# EAGLE design 3OR_1 (EAGLE 6.5.0)
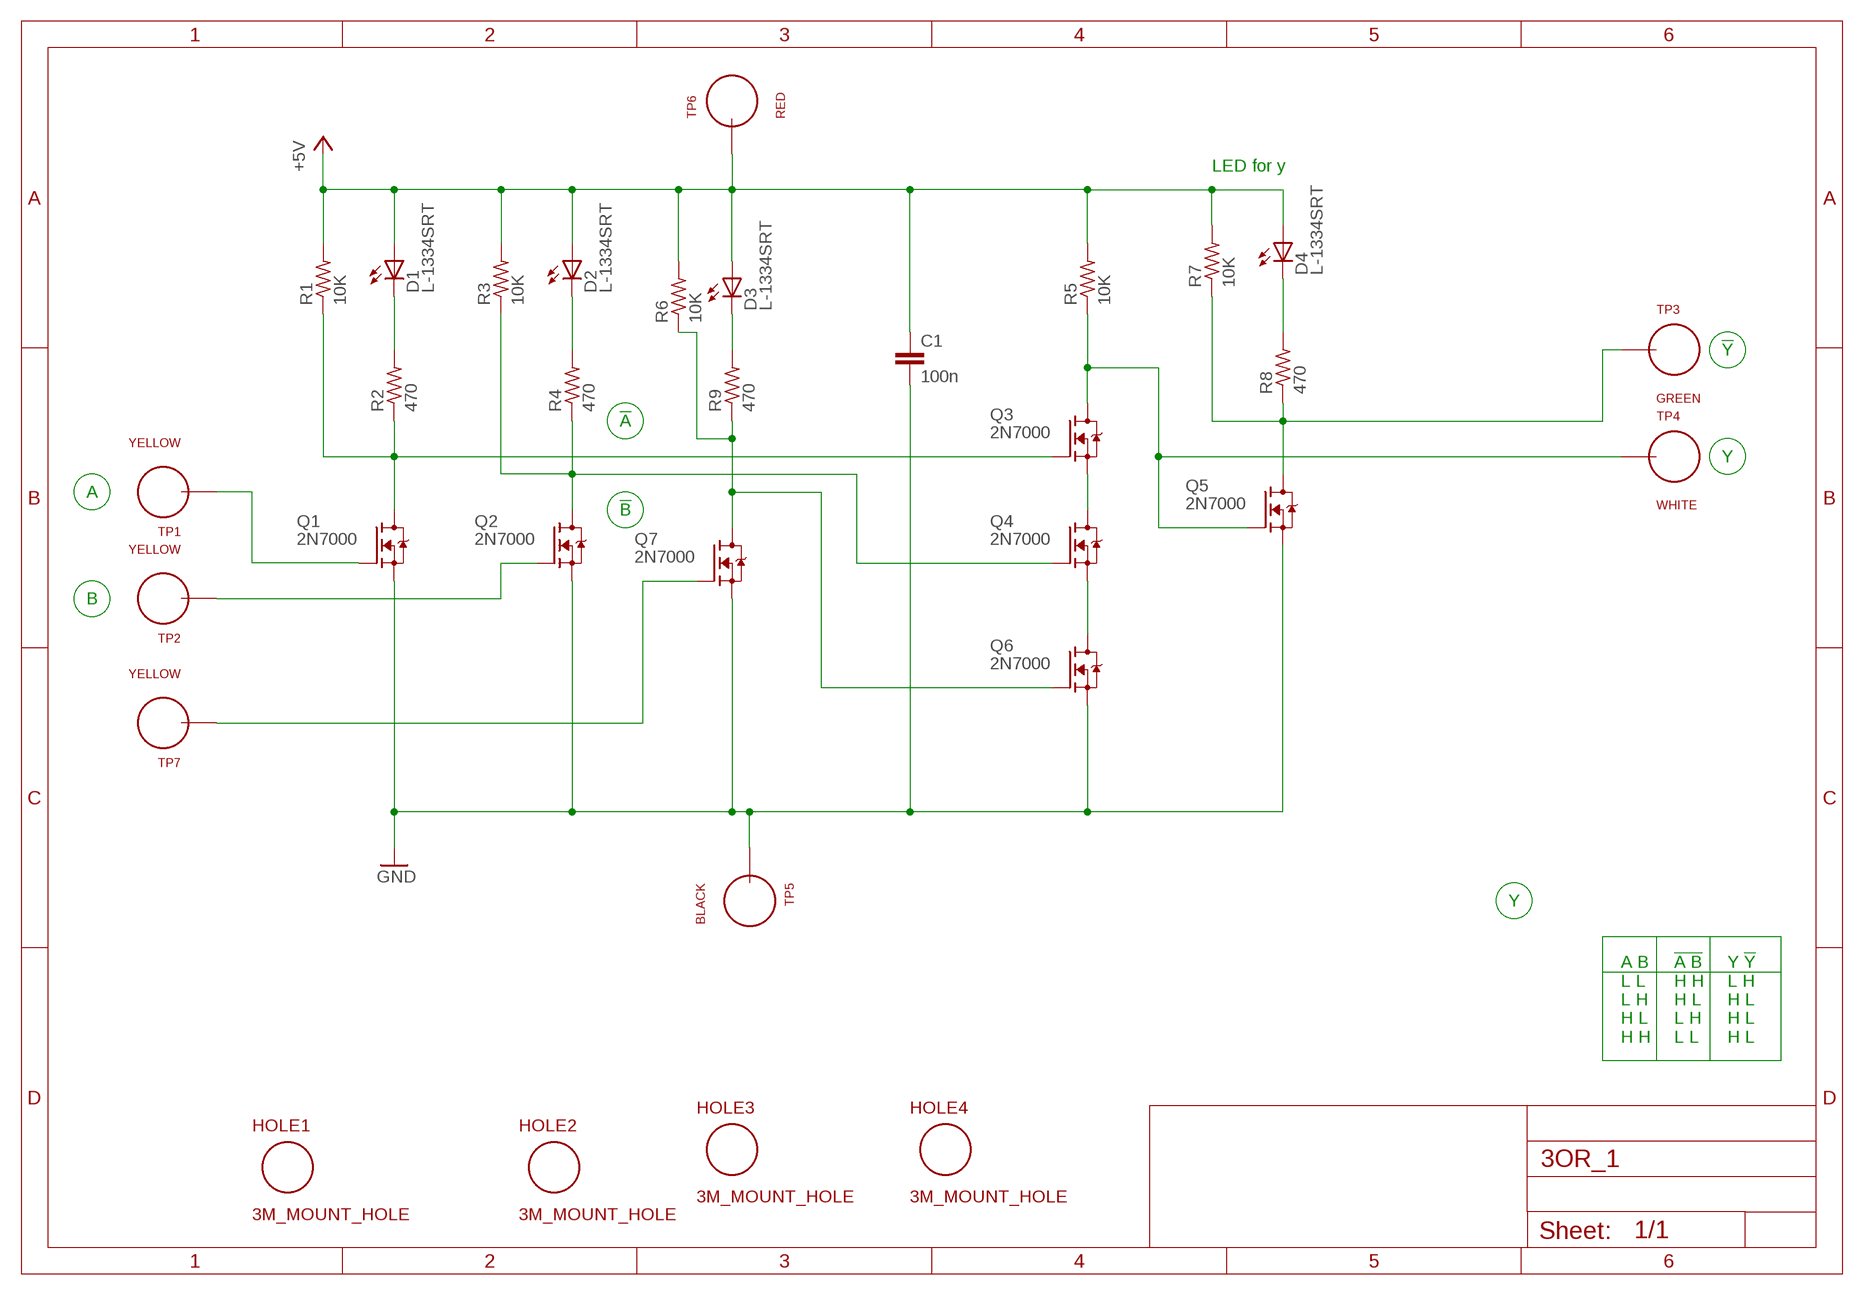
[diagram p0: schematic, sheet 1]

## Parts
C1  100n  C_P2INCH  [CAP_P2INCH]
D1  L-1334SRT  [LED3MM]
D2  L-1334SRT  [LED3MM]
D3  L-1334SRT  [LED3MM]
D4  L-1334SRT  [LED3MM]
HOLE1  3M_MOUNT_HOLE  [3M_HOLE]
HOLE2  3M_MOUNT_HOLE  [3M_HOLE]
HOLE3  3M_MOUNT_HOLE  [3M_HOLE]
HOLE4  3M_MOUNT_HOLE  [3M_HOLE]
Q1  2N7000  [TO92-DGS]
Q2  2N7000  [TO92-DGS]
Q3  2N7000  [TO92-DGS]
Q4  2N7000  [TO92-DGS]
Q5  2N7000  [TO92-DGS]
Q6  2N7000  [TO92-DGS]
Q7  2N7000  [TO92-DGS]
R1  10K  R_P2INCH  [R_P2INCH]
R2  470  R_P2INCH  [R_P2INCH]
R3  10K  R_P2INCH  [R_P2INCH]
R4  470  R_P2INCH  [R_P2INCH]
R5  10K  R_P2INCH  [R_P2INCH]
R6  10K  R_P2INCH  [R_P2INCH]
R7  10K  R_P2INCH  [R_P2INCH]
R8  470  R_P2INCH  [R_P2INCH]
R9  470  R_P2INCH  [R_P2INCH]
TP1  YELLOW  TEST_LOOP  [TEST_LOOP]
TP2  YELLOW  TEST_LOOP  [TEST_LOOP]
TP3  GREEN  TEST_LOOP  [TEST_LOOP]
TP4  WHITE  TEST_LOOP  [TEST_LOOP]
TP5  BLACK  TEST_LOOP  [TEST_LOOP]
TP6  RED  TEST_LOOP  [TEST_LOOP]
TP7  YELLOW  TEST_LOOP  [TEST_LOOP]

## Nets
+5V: C1.1 D1.A D2.A D3.A D4.A R1.2 R3.2 R5.2 R6.2 R7.2 TP6.P$1
GND: C1.2 Q1.S Q2.S Q5.S Q6.S Q7.S TP5.P$1
N$1: Q3.D Q5.G R5.1 TP4.P$1
N$2: Q3.S Q4.D
N$3: D4.K(C) R8.2
N$4: Q5.D R7.1 R8.1 TP3.P$1
N$5: Q4.S Q6.D
N$6: D2.K(C) R4.2
N$7: Q2.D Q4.G R3.1 R4.1
N$8: D1.K(C) R2.2
N$9: Q1.D Q3.G R1.1 R2.1
N$10: D3.K(C) R9.2
N$11: Q1.G TP1.P$1
N$12: Q2.G TP2.P$1
N$13: Q6.G Q7.D R6.1 R9.1
N$16: Q7.G TP7.P$1

## Notes on the sheet
- LED for y
- !Y
- !A
- Y
- A
- !B
- B
- Y
- A B
  L L
  L H
  H L
  H H
- !A B
  H H
  H L
  L H
  L L
- Y !Y
  L H
  H L
  H L
  H L

## Library data of the parts
C1 = MyLib:C_P2INCH
D1-D4 = MyLib:L-1334SRT
HOLE1-HOLE4 = MyLib:3M_MOUNT_HOLE
Q1-Q7 = MyLib:2N7000
R1-R9 = MyLib:R_P2INCH
TP1-TP7 = MyLib:TEST_LOOP

## Board
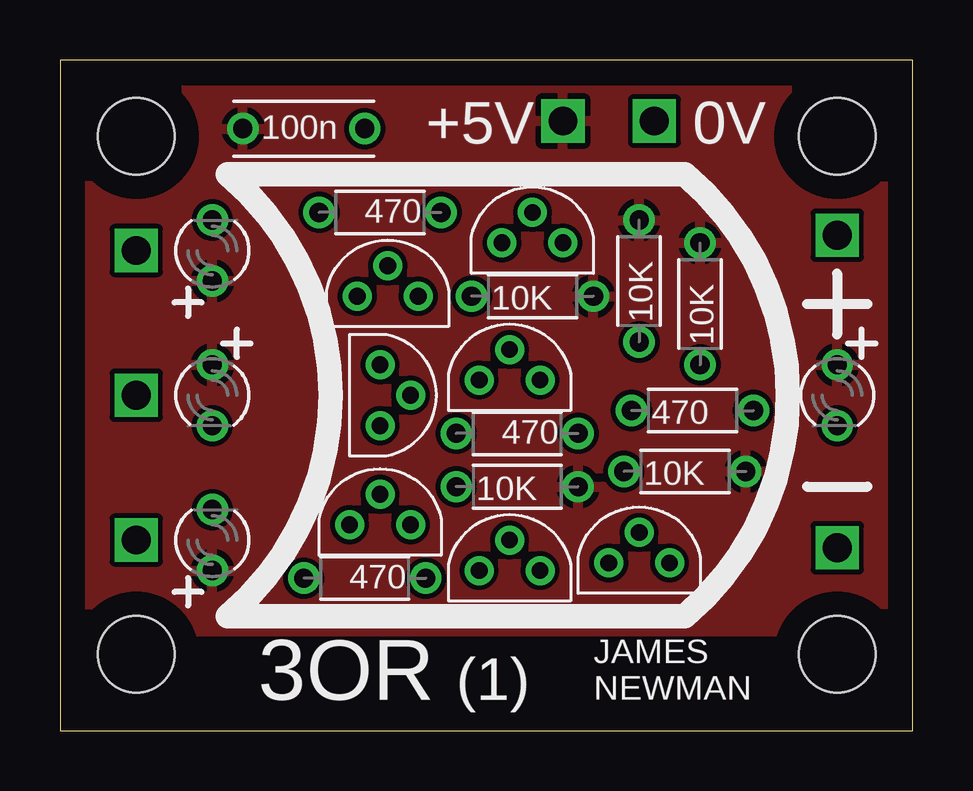
[diagram p1: board, top side]
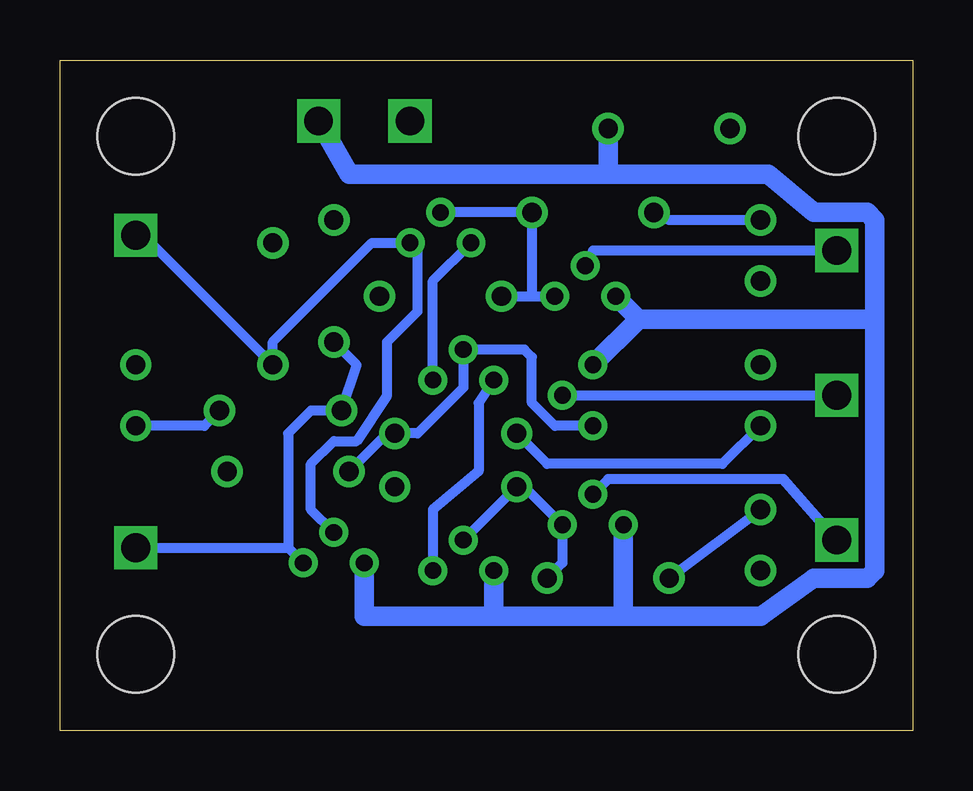
[diagram p2: board, bottom side, seen from below]

Size 35.54 x 27.94 mm. Coordinates in mm from the lower left corner, seen from the top.
Outline: 0,0 35.54,0 35.54,27.94 0,27.94 0,0
Copper layers (1*16): Top 0.035mm / dielectric 1.5mm / Bottom 0.035mm
Design rules "processor_rules *": minimum track width 10mil, minimum drill 0.0236mm, track to track 8mil, track to pad 8mil, pad to pad 8mil, via to via 8mil, smd to smd 8mil, copper to edge 40mil, drill to drill 8mil, minimum pad ring 10mil, minimum via ring 8mil, stop-mask expansion 4mil, vias tented up to drill 0.7mm, thermal gap 10mil

### Footprints (pad centres in the part's own frame; a part is rotated, then mirrored left to right if it is on the bottom)
CAP_P2INCH = drill 0.8: 1 -2.54,0; 2 2.54,0
LED3MM = drill 0.8: A -1.27,0; K 1.27,0
3M_HOLE = hole 3.2: 0,0
TO92-DGS = drill 0.7: D 0,1.27; G -1.27,0; S 0,-1.27
R_P2INCH = drill 0.8: 1 -2.54,0; 2 2.54,0
TEST_LOOP = drill 1.2 square: P$1 0,0

### Placement (x,y rotation side)
C1  10.16,25.08 0 top
D1  6.35,20 90 top
D2  6.35,13.97 270 top
D3  6.35,7.94 90 top
D4  32.38,13.97 270 top
HOLE1  3.17,3.17 0 top
HOLE2  3.17,24.77 0 top
HOLE3  32.38,3.17 0 top
HOLE4  32.38,24.77 0 top
Q1  13.65,18.1 270 top
Q2  13.34,13.97 180 top
Q3  19.68,20.32 270 top
Q4  18.73,14.61 270 top
Q5  24.13,6.99 270 top
Q6  18.73,6.67 270 top
Q7  13.34,8.57 270 top
R1  19.68,18.1 0 top
R2  13.34,21.59 180 top
R3  26.04,10.79 0 top
R4  19.05,12.38 180 top
R5  26.67,17.78 90 top
R6  19.05,10.16 0 top
R7  24.13,18.73 90 top
R8  26.35,13.34 0 top
R9  12.7,6.35 180 top
TP1  3.17,20 0 top
TP2  3.17,13.97 0 top
TP3  32.38,7.62 0 top
TP4  32.38,20.64 0 top
TP5  24.77,25.4 0 top
TP6  20.95,25.4 0 top
TP7  3.17,7.94 0 top

### Tracks (layer width: path | path; a pad name or v marks a point on that pad's centre or on a via)
+5V
  pour Top: 1.27,26.67 34.29,26.67 34.29,4.13 1.27,4.13
GND
  Bottom 0.813: 11.43,17.14 1.59,17.14 | 1.59,17.14 1.59,6.67 1.91,6.35 4.13,6.35 6.35,4.76 12.06,4.76 | 12.06,4.76 Q7.S | Q6.S 17.46,4.76 | 17.46,4.76 12.06,4.76 | 1.59,17.14 1.59,21.27 1.91,21.59 4.13,21.59 6.03,23.18 12.7,23.18 | 17.46,4.76 22.86,4.76 Q5.S | 11.43,17.14 Q1.S | Q2.S 11.43,17.14 | TP5.P$1 23.5,23.18 12.7,23.18 | C1.2 12.7,23.18
N$1
  Bottom 0.406: Q5.G 25.08,9.21 25.08,11.11 24.13,12.06 23.18,12.06 21.91,13.97 21.91,16.19 20.64,17.46 20.64,20 Q3.D 22.54,20.32 26.67,16.19 R5.1 32.07,20.64 TP4.P$1
N$2
  Bottom 0.406: Q4.D 20,18.73 Q3.S
N$3
  Bottom 0.406: R8.2 29.53,12.7 D4.K
N$4
  Bottom 0.406: TP3.P$1 26.04,7.62 | 26.04,7.62 Q5.D | R7.1 23.18,15.24 R8.1 25.08,13.34 26.04,12.38 26.04,7.62
N$5
  Bottom 0.406: Q4.S 18.1,13.65 18.1,10.79 20,9.21 Q6.D
N$6
  Bottom 0.406: D2.K 7.94,11.11 15.24,11.11 R4.2
N$7
  Bottom 0.406: Q2.D 14.92,12.7 15.88,13.65 15.88,15.56 16.19,15.88 Q4.G 18.73,14.29 20.64,12.38 R4.1 21.91,12.38 R3.1
N$8
  Bottom 0.406: D1.K 10.16,21.27 R2.2
N$9
  Bottom 0.406: Q3.G R2.1 15.88,18.1 | 15.88,18.1 Q1.D | R1.1 15.88,18.1
N$10
  Bottom 0.406: D3.K R9.2
N$11
  Bottom 0.406: TP1.P$1 13.34,20 Q1.G
N$12
  Bottom 0.406: Q2.G TP2.P$1
N$13
  Bottom 0.406: Q6.G R6.1 16.19,10.16 Q7.D 14.61,6.99 R9.1
N$16
  Bottom 0.406: TP7.P$1 5.4,10.48 12.7,10.48 Q7.G

### Text on the board
tPlace: +5V | 0V | 3OR | (1) | JAMES / NEWMAN